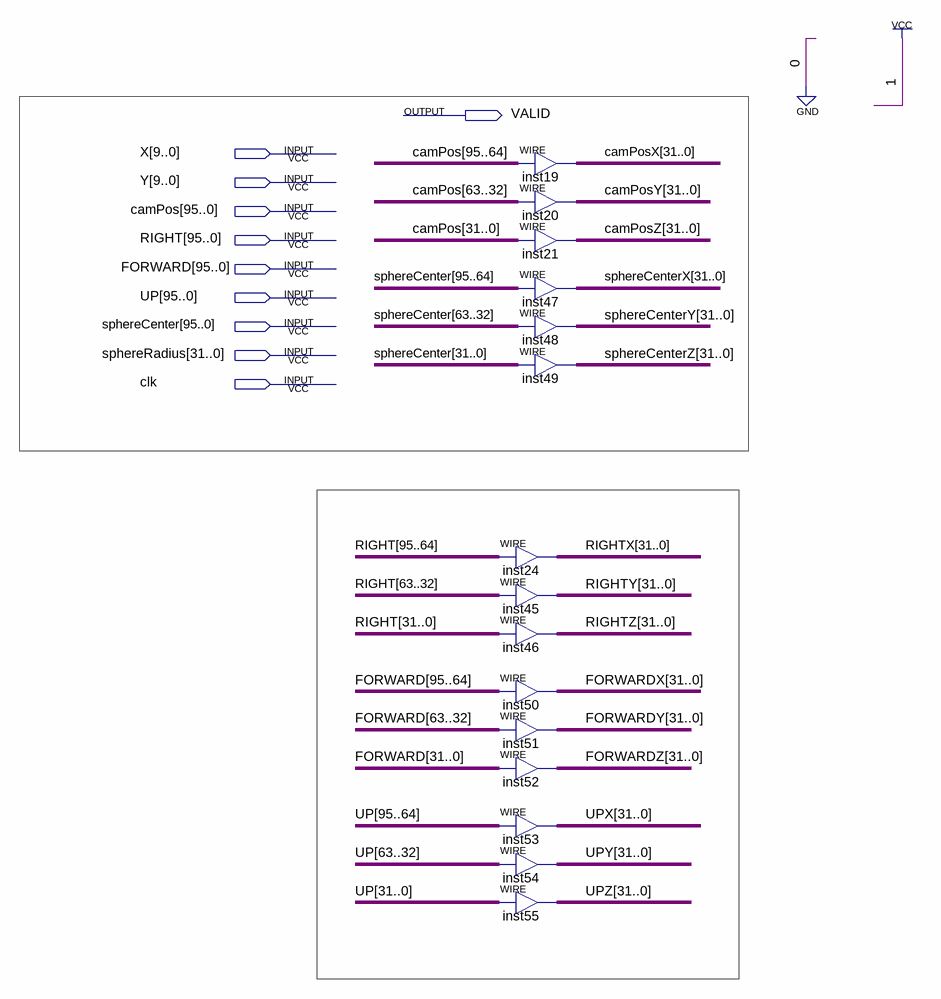
[diagram p0: schematic sheet]
// Quartus schematic layer_sphere2.bdf as structural Verilog: 15 symbols, 10 pins
module layer_sphere2 (
  input  [9:0] X,
  input  [9:0] Y,
  input  [95:0] camPos,
  input  [95:0] RIGHT,
  input  [95:0] FORWARD,
  input  [95:0] UP,
  input  [95:0] sphereCenter,
  input  [31:0] sphereRadius,
  input  clk,
  output VALID
);

  wire [31:0] camPosX, camPosY, camPosZ, FORWARDX, FORWARDY, FORWARDZ, RIGHTX, RIGHTY, RIGHTZ, sphereCenterX,
       sphereCenterY, sphereCenterZ, UPX, UPY, UPZ;

  assign camPosX = camPos[95:64];  // WIRE inst19
  assign camPosY = camPos[63:32];  // WIRE inst20
  assign camPosZ = camPos[31:0];  // WIRE inst21
  assign sphereCenterX = sphereCenter[95:64];  // WIRE inst47
  assign sphereCenterY = sphereCenter[63:32];  // WIRE inst48
  assign sphereCenterZ = sphereCenter[31:0];  // WIRE inst49
  assign RIGHTX = RIGHT[95:64];  // WIRE inst24
  assign RIGHTY = RIGHT[63:32];  // WIRE inst45
  assign RIGHTZ = RIGHT[31:0];  // WIRE inst46
  assign FORWARDX = FORWARD[95:64];  // WIRE inst50
  assign FORWARDY = FORWARD[63:32];  // WIRE inst51
  assign FORWARDZ = FORWARD[31:0];  // WIRE inst52
  assign UPX = UP[95:64];  // WIRE inst53
  assign UPY = UP[63:32];  // WIRE inst54
  assign UPZ = UP[31:0];  // WIRE inst55
endmodule
